# Altium schematic sheet SnapItRev1.SchDoc: Snap-It Rev1
size A; Author: Callum Neely; Revision: 1; SheetNumber: 1; SheetTotal: 2
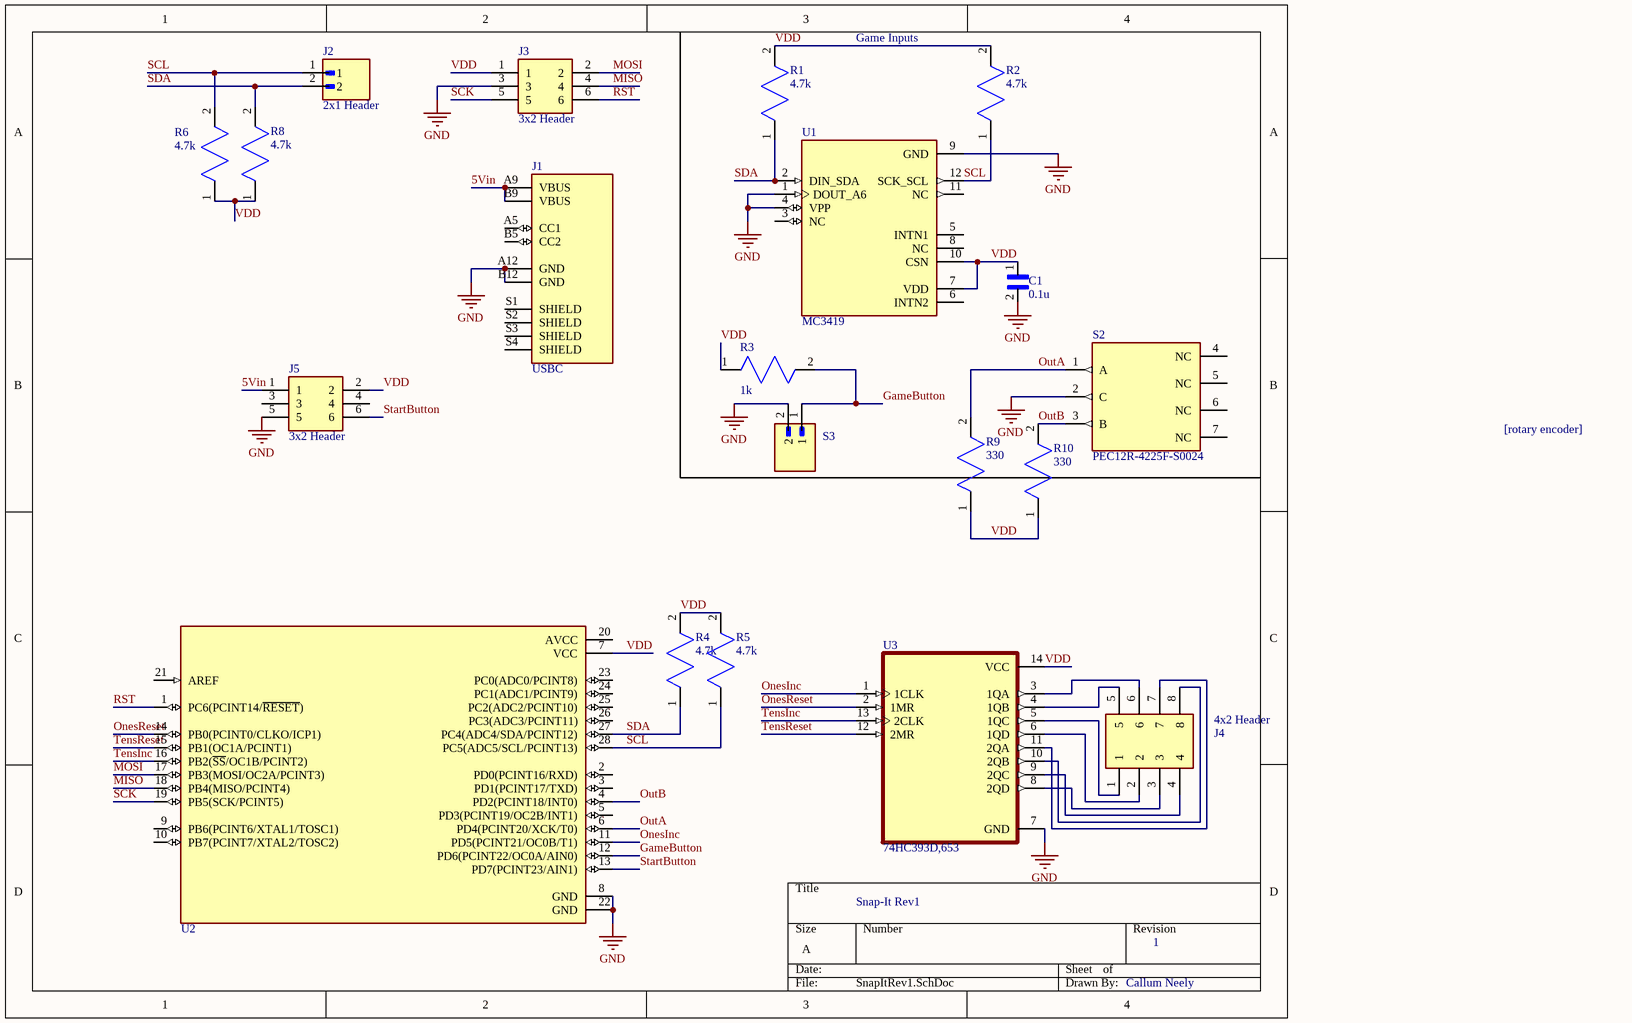
[diagram p0: SnapItRev1.SchDoc]

## Parts
C1  0.1u  [0402Basic]
J1  USBC  [USBC]
J2  2x1 Header  [2x1 Header]
J3  3x2 Header  [3x2 Header]
J4  4x2 Header  [4x2 Header]
J5  3x2 Header  [3x2 Header]
R1  4.7k  [0402Basic]
R2  4.7k  [0402Basic]
R3  1k  [0402Basic]
R4  4.7k  [0402Basic]
R5  4.7k  [0402Basic]
R6  4.7k  [0402Basic]
R8  4.7k  [0402Basic]
R9  330  [0402Basic]
R10  330  [0402Basic]
S2  PEC12R-4225F-S0024  [Rotary Encoder]
S3  2x1 Header  [2x1 Header]  (value not drawn)
U1  MC3419  [12-VFLGA]
U2  ATMEGA328PU  [ATMEGA328P]  (value not drawn)
U3  74HC393D,653  [SOIC14 3.9mm]

## Nets
GND: C1.2 J1.A12(GND) J1.B12(GND) J3.3 J5.5 S2.2(C) S3.2 U1.1(DOUT_A6) U1.4(VPP) U1.9(GND) U2.8(GND) U2.22(GND) U3.7(GND)
5Vin: J1.A9(VBUS) J1.B9(VBUS) J5.1
GameButton: R3.2(=name) S3.1 U2.12(PD6(PCINT22/OC0A/AIN0))
MISO: J3.4 U2.18(PB4(MISO/PCINT4))
MOSI: J3.2 U2.17(PB3(MOSI/OC2A/PCINT3))
OnesInc: U2.11(PD5(PCINT21/OC0B/T1)) U3.1(1CLK)
OnesReset: U2.14(PB0(PCINT0/CLKO/ICP1)) U3.2(1MR)
OutA: R9.2(=name) S2.1(A) U2.6(PD4(PCINT20/XCK/T0))
OutB: R10.2(=name) S2.3(B) U2.4(PD2(PCINT18/INT0))
RST: J3.6 U2.1(PC6(PCINT14/~{RESET}))
SCK: J3.5 U2.19(PB5(SCK/PCINT5))
SCL: J2.1 R2.1(=name) R5.1(=name) R6.2(=name) U1.12(SCK_SCL) U2.28(PC5(ADC5/SCL/PCINT13))
SDA: J2.2 R1.1(=name) R4.1(=name) R8.2(=name) U1.2(DIN_SDA) U2.27(PC4(ADC4/SDA/PCINT12))
StartButton: J5.6 U2.13(PD7(PCINT23/AIN1))
TensInc: U2.16(PB2(~{SS}/OC1B/PCINT2)) U3.13(2CLK)
TensReset: U2.15(PB1(OC1A/PCINT1)) U3.12(2MR)
VDD: C1.1 J3.1 J5.2 R1.2(=name) R2.2(=name) R3.1(=name) R4.2(=name) R5.2(=name) R6.1(=name) R8.1(=name) R9.1(=name) R10.1(=name) U1.7(VDD) U1.10(CSN) U2.7(VCC) U3.14(VCC)
NetJ4_1: J4.1 U3.5(1QC)
NetJ4_2: J4.2 U3.6(1QD)
NetJ4_3: J4.3 U3.8(2QD)
NetJ4_4: J4.4 U3.9(2QC)
NetJ4_5: J4.5 U3.4(1QB)
NetJ4_6: J4.6 U3.3(1QA)
NetJ4_7: J4.7 U3.11(2QA)
NetJ4_8: J4.8 U3.10(2QB)

Not connected (* = marked no-connect by the designer): J1 A5(CC1) B5(CC2) S1(SHIELD) S2(SHIELD) S3(SHIELD) S4(SHIELD); J5 3 4; S2 4(NC) 5(NC) 6(NC) 7(NC); U1 3(NC) 5(INTN1) 6(INTN2) 8(NC) 11(NC); U2 2(PD0(PCINT16/RXD)) 3(PD1(PCINT17/TXD)) 5(PD3(PCINT19/OC2B/INT1)) 9(PB6(PCINT6/XTAL1/TOSC1)) 10(PB7(PCINT7/XTAL2/TOSC2)) 20(AVCC) 21(AREF) 23(PC0(ADC0/PCINT8)) 24(PC1(ADC1/PCINT9)) 25(PC2(ADC2/PCINT10)) 26(PC3(ADC3/PCINT11))

## Notes on the sheet
- Game Inputs
- [rotary encoder]

## Library data of the parts
C1 = CAP: Value: 0.01uF
R1-R6 R8-R10 = RES
S2 = PEC12R-4225F-S0024: ROTARY ENCODER MECHANICAL 24PPR
U1 = MC3419: 3-AXIS ACCELEROMETER
U3 = 74HC393D,653: 4 bit Counter